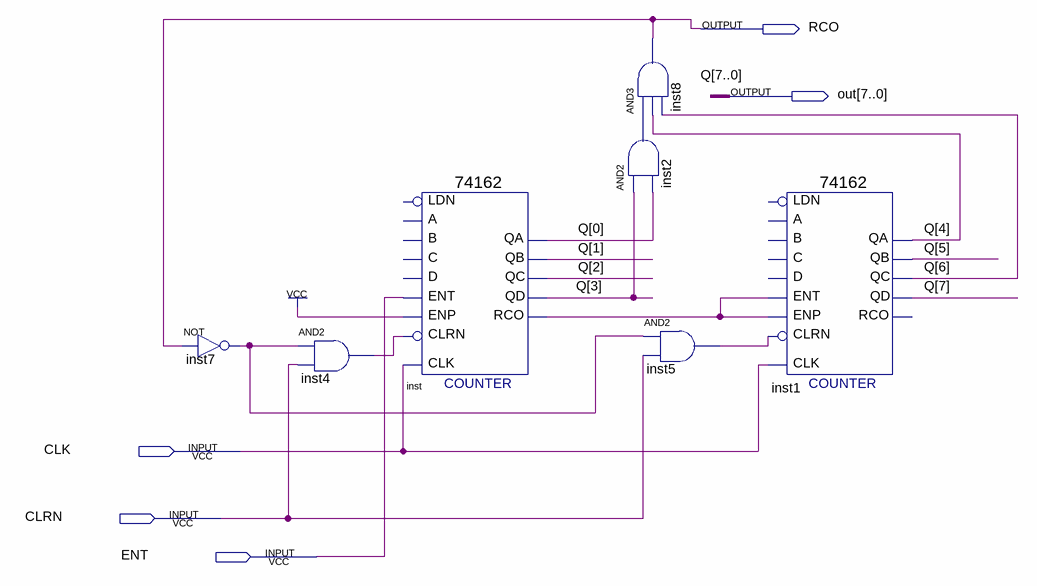
[diagram p0: schematic sheet]
// Quartus schematic 59Counter.bdf as structural Verilog: 7 symbols, 5 pins
module \59Counter  (
  input  CLK,
  input  CLRN,
  input  ENT,
  output RCO,
  output [7:0] out
);

  wire inst2_out, inst4_out, inst5_out, inst7_out, inst_rco;

  not inst7 (inst7_out, RCO);
  and inst4 (inst4_out, inst7_out, CLRN);
  \74162  inst (
    .ENP(1'b1), .ENT(ENT), .CLRN(inst4_out), .CLK(CLK), .QA(out[0]), .QB(out[1]), .QC(out[2]), .QD(out[3]),
    .RCO(inst_rco));  // open: A, LDN, B, C, D
  and inst8 (RCO, inst2_out, out[4], out[6]);
  and inst2 (inst2_out, out[3], out[0]);
  and inst5 (inst5_out, inst7_out, CLRN);
  \74162  inst1 (
    .ENP(inst_rco), .ENT(inst_rco), .CLRN(inst5_out), .CLK(CLK), .QA(out[4]), .QB(out[5]), .QC(out[6]),
    .QD(out[7]));  // open: A, LDN, B, C, D, RCO

  // Other names for the same wires on the sheet: Q[7:0] = out
endmodule
